# EAGLE design SinglePowerSupply (EAGLE 9.6.2)
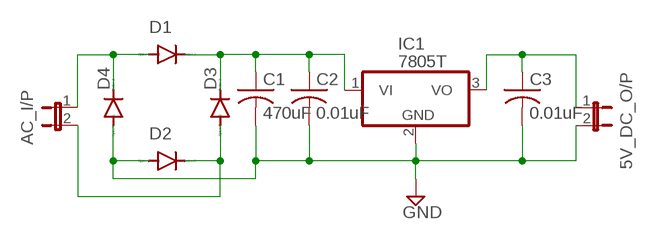
[diagram p0: schematic, sheet 1]

## Parts
5V_DC_O/P  JP1E  [JP1]
AC_I/P  JP1E  [JP1]
C1  470uF  C-US025_050-025X075  [C025_050-025X075]
C2  0.01uF  C-US025_050-025X075  [C025_050-025X075]
C3  0.01uF  C-US025_050-025X075  [C025_050-025X075]
D1  1N4004  [DO41-10]
D2  1N4004  [DO41-10]
D3  1N4004  [DO41-10]
D4  1N4004  [DO41-10]
IC1  7805T  [TO220H]

## Nets
GND: 5V_DC_O/P.2 C1.2 C2.2 C3.2 D2.A D4.A IC1.2(GND)
N$1: AC_I/P.1 D1.A D4.C
N$2: C1.1 C2.1 D1.C D3.C IC1.1(VI)
N$3: AC_I/P.2 D2.C D3.A
N$5: 5V_DC_O/P.1 C3.1 IC1.3(VO)

## Library data of the parts
5V_DC_O/P AC_I/P = jumper:JP1E: JUMPER
C1-C3 = adafruit:C-US: CAPACITOR, American symbol
D1-D4 = diode:1N4004: DIODE general purpose rectifier, 1 A
IC1 = linear:78*: Positive VOLTAGE REGULATOR Source: http://cache.national.com/ds/LM/LM78L05.pdf http://www.fairchildsemi.com/ds/LM/LM7805.pdf

## Board
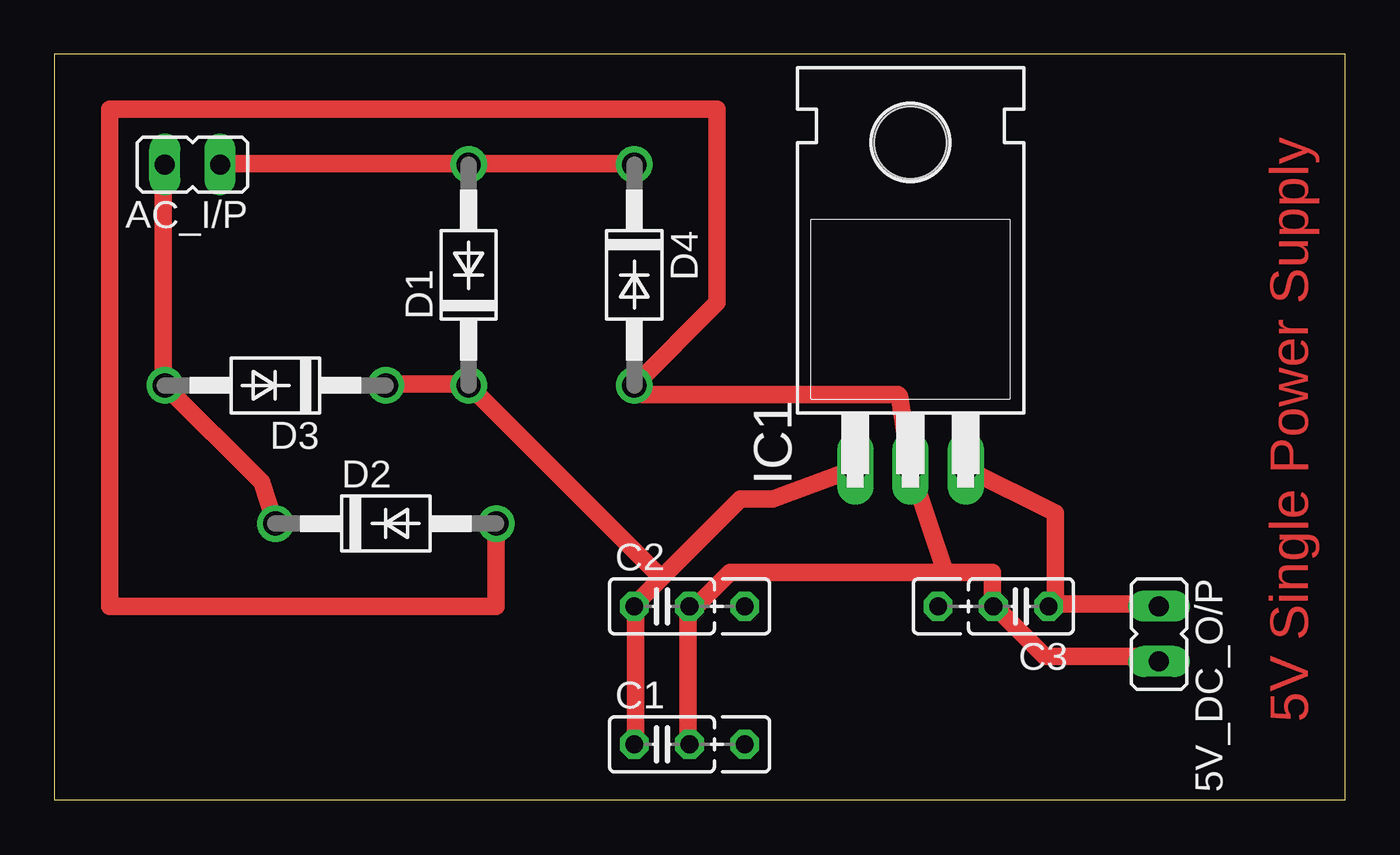
[diagram p1: board, top side]

Size 59.36 x 34.28 mm. Coordinates in mm from the lower left corner, seen from the top.
Outline: 0,0 59.36,0 59.36,34.28 0,34.28 0,0
Copper layers (1*16): Top 0.035mm / dielectric 1.5mm / Bottom 0.035mm
Design rules "default *": minimum track width 32mil, minimum drill 0.35mm, track to track 6mil, track to pad 6mil, pad to pad 6mil, via to via 6mil, smd to smd 6mil, copper to edge 40mil, drill to drill 6mil, minimum pad ring 10mil, minimum via ring 8mil, stop-mask expansion 4mil, vias tented up to drill 0mil, thermal gap 10mil

### Footprints (pad centres in the part's own frame; a part is rotated, then mirrored left to right if it is on the bottom)
JP1 = drill 0.914 long: 1 0,-1.27; 2 0,1.27
C025_050-025X075 = drill 0.813 octagon: 1 -1.27,0; 2 1.27,0; 3 3.81,0
DO41-10 = drill 1.118: A 5.08,0; C -5.08,0
TO220H = drill 1.118 long: 1 -2.54,-10.16; 2 0,-10.16; 3 2.54,-10.16 | hole 3.302: 0,4.826

### Placement (x,y rotation side)
5V_DC_O/P  50.8,7.62 180 top
AC_I/P  6.35,29.21 90 top
C1  27.94,2.54 0 top
C2  27.94,8.89 0 top
C3  44.45,8.89 180 top
D1  19.05,24.13 90 top
D2  15.24,12.7 0 top
D3  10.16,19.05 180 top
D4  26.67,24.13 270 top
IC1  39.37,25.4 0 top

### Tracks (layer width: path | path; a pad name or v marks a point on that pad's centre or on a via)
GND
  Top 0.813: 20.22,12.93 D2.A 20.32,8.89 2.54,8.89 2.54,31.75 30.48,31.75 30.48,22.86 D4.A 27.08,18.64 38.79,18.64 38.86,18.57 IC1.2 40.97,10.44 | C1.2 29.13,2.62 29.13,8.51 C2.2 29.62,8.99 31.06,10.44 40.97,10.44 | 5V_DC_O/P.2 50.77,6.58 45.54,6.58 43.61,8.51 C3.2 43.13,8.99 43.13,10.44 40.97,10.44
N$1
  Top 0.813: AC_I/P.1 7.9,29.26 19,29.26 D1.A 19.48,29.26 26.59,29.26 D4.C
N$2
  Top 0.813: D3.C 15.62,19.13 19,19.13 D1.C 19.48,18.64 27.93,10.2 | C1.1 26.72,2.72 26.72,8.51 C2.1 26.72,8.99 27.93,10.2 | 27.93,10.2 31.55,13.82 33.04,13.82 IC1.1
N$3
  Top 0.813: AC_I/P.2 5,28.78 5,19.13 D3.A 9.53,14.61 D2.C
N$5
  Top 0.813: 46.02,8.99 46.02,13.18 IC1.3 | 46.02,8.99 50.77,8.99 5V_DC_O/P.1 | 46.02,8.99 C3.1

### Text on the board
Top: 5V Single Power Supply